# EasyEDA Pro project ProDoc_XC7K35T_GTP_USB_Core_LiteRevB.1.brd_2025-10-08.epro, board EA3059_4CH_BUCK_CBB
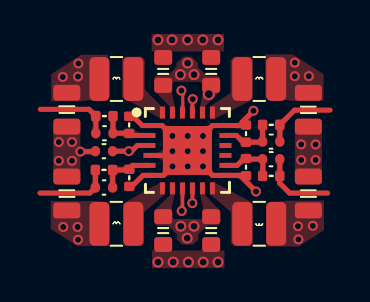
[diagram p13: board, top side]
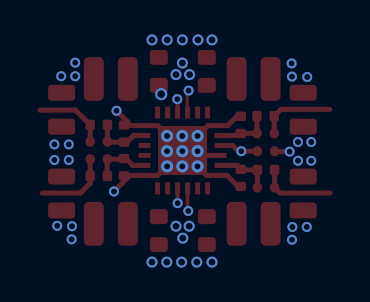
[diagram p14: board, bottom side, seen from below]

No outline. copper layers: Top Layer, Bottom Layer. Coordinates in mm from the lowest, leftmost part position.
Stack: Top Layer 0.035mm / Dielectric1 1.51mm FR4 er 4.5 / Bottom Layer 0.035mm

## Design rules (mm)
template: JLCPCB Capability(Two Layers Board)
spacing copperThickness1oz (default): track to track 0.102, other pairs 0.152 to 0.3
spacing copperThickness2oz: track to track 0.203, other pairs 0.152 to 0.3
track width copperThickness1oz (default): min 0.127, default 0.254, max 2.54
track width copperThickness2oz: min 0.203, default 0.254, max 2.54
differential pair differentialPair (default): width min 0.127, default 0.254, max 2.54; gap min 0.152, default 0.152
via viaSize (default): diameter min 0.5, default 0.61, max 10; hole min 0.3, default 0.305, max 6.3

## Placement (name value [footprint] x y rotation side)
C6  220pF  [C0402_1005M_S]  10.22 4.46 0 top
C7  220pF  [C0402_1005M_S]  1.88 4.88 180 top
C14  22uF  [C0805_2012M_S]  0 6.06 270 top
C15  22uF  [C0805_2012M_S]  12.08 6.06 90 top
C18  22uF  [C0603_1608M_S]  4.82 7.98 270 top
C19  22uF  [C0603_1608M_S]  7.22 0 90 top
C20  22uF  [C0603_1608M_S]  7.22 7.98 270 top
C21  22uF  [C0603_1608M_S]  4.82 0 90 top
C22  2.2uF  [C0402_1005M_S]  1.86 3.98 0 top
C23  220pF  [C0402_1005M_S]  1.86 2.16 180 top
C24  22uF  [C0805_2012M_S]  0 1.86 90 top
C25  220pF  [C0402_1005M_S]  10.22 3.58 0 top
C26  22uF  [C0805_2012M_S]  12.08 1.86 90 top
L3  2.2uH  [IND-SMD_L2.5-W2.0-L2520M]  2.48 7.6 0 top
L4  2.2uH  [IND-SMD_L2.5-W2.0-L2520M]  9.62 7.6 0 top
L5  2.2uH  [IND-SMD_L2.5-W2.0-L2520M]  2.48 0.34 0 top
L6  2.2uH  [IND-SMD_L2.5-W2.0-L2520M]  9.62 0.34 180 top
R10  453kΩ  [R0402_1005M_S]  10.22 5.3 0 top
R11  200kΩ  [R0402_1005M_S]  1.88 5.74 0 top
R12  100kΩ  [R0402_1005M_S]  8.96 4.86 270 top
R15  100kΩ  [R0402_1005M_S]  3.12 5.3 90 top
R16  150kΩ  [R0402_1005M_S]  1.86 3.04 0 top
R17  100kΩ  [R0402_1005M_S]  3.12 2.64 270 top
R18  68kΩ  [R0402_1005M_S]  10.22 2.74 180 top
R19  100kΩ  [R0402_1005M_S]  8.96 3.18 270 top
U1  EA3059  [VQFN-24_L4.0-W4.0-P0.50-TL-EP2.5]  6.03 4.02 0 top

## Footprints (pads in the part's own frame, mm; a bottom-side part is the same pattern mirrored in y, then rotated)
C0402_1005M_S
  rrect 0.47x0.52 smd: 1(-0.43,0) 2(0.43,0)
C0603_1608M_S
  rrect 0.75x0.9 smd: 1(-0.7,0) 2(0.7,0)
C0805_2012M_S
  rrect 0.8x1.35 smd: 1(-0.85,0) 2(0.85,0)
IND-SMD_L2.5-W2.0-L2520M
  rrect 1x2.2 smd: 1(-0.85,0) 2(0.85,0)
R0402_1005M_S
  rrect 0.47x0.52 smd: 1(-0.43,0) 2(0.43,0)
VQFN-24_L4.0-W4.0-P0.50-TL-EP2.5
  rect 0.6x0.25 smd: 1(-1.9,1.25) 2(-1.9,0.75) 3(-1.9,0.25) 4(-1.9,-0.25) 5(-1.9,-0.75) 6(-1.9,-1.25) 13(1.9,-1.25) 14(1.9,-0.75) 15(1.9,-0.25) 16(1.9,0.25) 17(1.9,0.75) 18(1.9,1.25)
  rect 0.25x0.6 smd: 7(-1.25,-1.9) 8(-0.75,-1.9) 9(-0.25,-1.9) 10(0.249,-1.9) 11(0.75,-1.9) 12(1.25,-1.9) 19(1.25,1.9) 20(0.75,1.9) 21(0.249,1.9) 22(-0.25,1.9) 23(-0.75,1.9) 24(-1.25,1.9)
  rect 2.45x2.45 smd: 25(0,0)

## Nets
As in the schematic.

Pads without a net: U1 15 16

## Via types
v1: diameter 0.55, hole 0.35, Top Layer to Bottom Layer, 16 vias
v2: diameter 0.5, hole 0.3, Top Layer to Bottom Layer, 8 vias
v3: diameter 0.61, hole 0.4, Top Layer to Bottom Layer, 1 via
v4: diameter 0.5, hole 0.305, Top Layer to Bottom Layer, 20 vias
v5: diameter 0.61, hole 0.305, Top Layer to Bottom Layer, 9 vias

## Routing (per net, layer and track width the routed paths; a pad name or vN(x,y) marks a point on that pad's centre or on a via; arc(x,y) is an arc through that point)
GND: length 16.5
  Top Layer w0.254: U1.25 5.78,3.77 U1.4 ; U1.25 7.28,5.27 U1.18 8.77,5.27 8.77,5.44 v4(9.33,6.01) ; U1.25 7.28,2.77 U1.13 8.71,2.77 8.71,2.71 v4(9.46,1.96) ; R17.2 3.25,2.21 3.81,2.77 U1.6 4.83,2.77 v5(5.28,3.22) ; R15.2 3.31,5.73 3.77,5.27 U1.1 4.76,5.27 v5(5.28,4.74) ; C22.1 1.41,3.96 v4(0.68,3.96)
  vias: v1(4.56,9.56) v1(4.56,-1.58) v1(5.26,9.56) v1(5.32,-1.58) v1(6.04,9.56) v1(6.08,-1.58) v1(6.8,9.56) v1(6.82,-1.58) v1(7.56,9.56) v1(7.56,-1.58) v4(-0.4,4.44) v4(-0.4,3.5) v4(0.26,4.44) v4(0.26,3.5) v4(11.72,4.32) v4(11.72,3.54) v4(12.44,4.32) v4(12.44,3.54) v5(5.28,3.98) v5(6.05,4.74) v5(6.05,3.98) v5(6.05,3.22) v5(6.81,4.74) v5(6.81,3.98) v5(6.81,3.22)
VIN: length 2
  Top Layer w0.254: C22.2 v2(3.1,3.98) 3.24,3.98 3.53,4.27 U1.3
  vias: v1(5.68,7.82) v1(5.7,0.22) v1(6.04,8.4) v1(6.02,-0.38) v1(6.36,7.82) v1(6.36,0.22) v3(7.1,6.84)
EN1: length 0.7
  Top Layer w0.18: U1.10 6.28,1.38 v2(6.28,1.37)
EN2: length 1.1
  Top Layer w0.18: v2(5.75,0.98) 5.78,1.02 5.78,2.12
EN3: length 1.1
  Top Layer w0.15: 5.8,5.94 5.8,6.95 v2(5.73,7.02)
  Top Layer w0.18: 5.78,5.92 5.79,5.93
EN4: length 0.7
  Top Layer w0.18: v2(6.3,6.59) 6.28,6.57 6.28,5.95 6.32,5.91
VOUT1: length 3.8
  Top Layer w0.254: C25.2 R18.1 10.65,2.37 11.14,1.88 13.04,1.88
  vias: v4(11.56,0.22) v4(11.58,-0.44) v4(12.3,0.24)
VOUT2: length 3.8
  Top Layer w0.254: R16.1 C23.2 1.15,1.88 -1.34,1.88
  vias: v2(0.56,-0.46) v4(-0.18,0.18) v4(0.54,0.18)
VOUT3: length 3.8
  Top Layer w0.254: -1.32,6.08 1.11,6.08 R11.1 C7.2
  vias: v2(0.58,8.38) v2(0.56,7.72) v4(-0.2,7.7)
VOUT4: length 3.7
  Top Layer w0.254: 13.16,6.04 11.39,6.04 R10.2 C6.2
  vias: v4(11.4,8.42) v4(11.4,7.74) v4(12.1,7.74)
$1N1163: length 2.9
  Top Layer w0.254: U1.17 8.48,4.77 8.82,4.43 R12.2 9.76,4.43 C6.1 R10.1
$1N9621: length 2.7
  Top Layer w0.254: R11.2 C7.1 3.11,4.88 R15.1 3.22,4.77 U1.2
$1N9975: length 2.8
  Top Layer w0.254: U1.5 3.29,3.27 3.12,3.1 R17.1 3.09,3.04 R16.2 C23.1
$1N10206: length 2.9
  Top Layer w0.254: U1.14 8.52,3.27 8.86,3.61 R19.1 8.99,3.58 C25.1 9.8,3.57 9.8,2.75 R18.2

## Copper pours and planes (outline as drawn; the poured copper is in the pictures)
GND on Top Layer: -0.68,5.48 0.68,5.48 0.68,2.48 -0.68,2.48
GND on Top Layer: 11.4,5.48 12.76,5.48 12.76,2.48 11.4,2.48
GND on Top Layer: 4.24,9.86 7.86,9.86 7.86,8.98 4.24,8.98
GND on Top Layer: 4.26,-1 7.88,-1 7.88,-1.88 4.26,-1.88
VIN on Top Layer: 4.38,0.66 7.68,0.66 7.68,-0.7 4.38,-0.7
VIN on Top Layer: 4.42,7.64 5.38,7.64 5.38,6.12 4.42,6.12
VIN on Top Layer: 6.68,7.62 7.64,7.62 7.64,6.12 6.68,6.12
VIN on Top Layer: 4.42,1.96 5.38,1.96 5.38,0.46 4.42,0.46
VIN on Top Layer: 4.36,8.72 7.66,8.72 7.66,7.36 4.36,7.36
VIN on Top Layer: 6.68,1.98 7.64,1.98 7.64,0.48 6.68,0.48
VOUT1 on Top Layer: 9.98,1.5 12.86,1.5 12.86,-0.8 9.98,-0.8
VOUT2 on Top Layer: -0.8,1.48 2.12,1.48 2.12,-0.78 -0.8,-0.78
VOUT3 on Top Layer: -0.78,8.82 2.06,8.82 2.06,6.48 -0.78,6.48
VOUT4 on Top Layer: 9.92,8.84 12.84,8.84 12.84,6.5 9.92,6.5
$1N807 on Top Layer: 2.76,8.72 4.8,8.72 4.8,5.64 2.76,5.64
$1N809 on Top Layer: 7.16,8.72 9.3,8.72 9.3,5.62 7.16,5.62
$1N9972 on Top Layer: 2.82,2.4 4.9,2.4 4.9,-0.78 2.82,-0.78
$1N10203 on Top Layer: 7.16,2.4 9.32,2.4 9.32,-0.78 7.16,-0.78

Small or netless copper shapes (teardrops, artwork), in the pictures only: 62 on Top Layer

## Text on the board
Document Layer: FB3 | FB2 | FB1 | FB4
